# Altium project console_pcb_project.PrjPcb
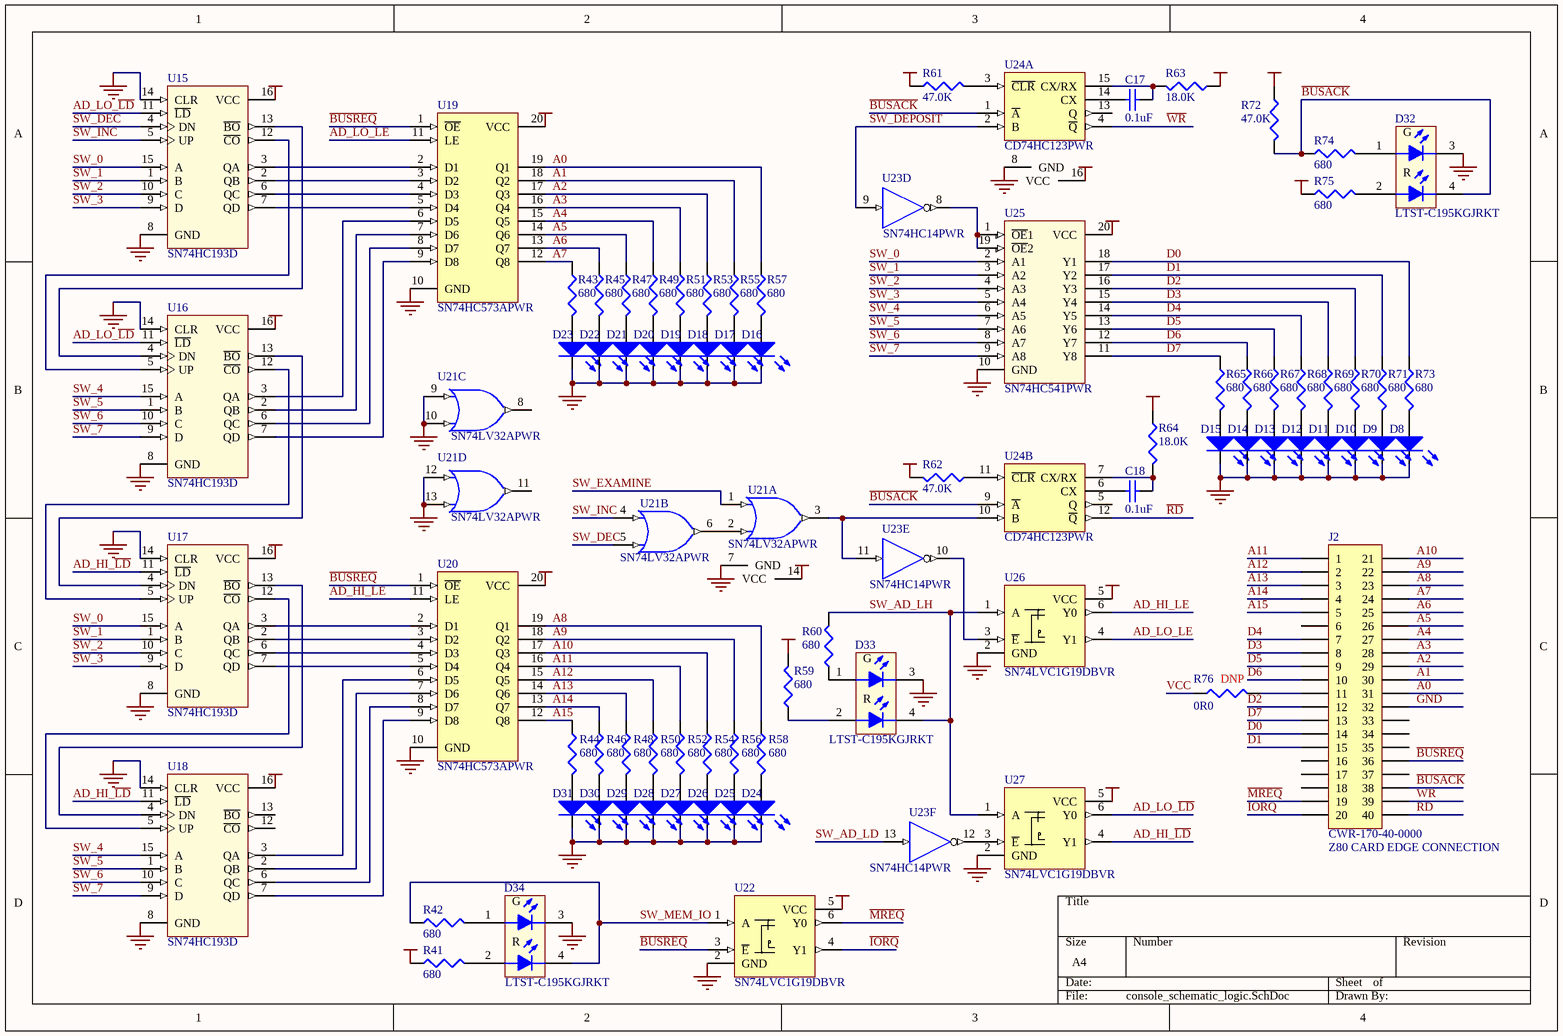
[diagram p0: console_schematic_logic.SchDoc]
2 sheets, 190 parts. Net scope: global (net labels, ports and power ports of the same name join across sheets).
Board file: console_pcb.PcbDoc
Sheets:
  console_schematic_logic.SchDoc
  console_schematic_switches.SchDoc

## Sheet console_schematic_logic.SchDoc
size A4

### Parts
C17  0.1uF  [0603]
C18  0.1uF  [0603]
D8  LTST-C190KRKT  [APG1608]  (value not drawn)
D9  LTST-C190KRKT  [APG1608]  (value not drawn)
D10  LTST-C190KRKT  [APG1608]  (value not drawn)
D11  LTST-C190KRKT  [APG1608]  (value not drawn)
D12  LTST-C190KRKT  [APG1608]  (value not drawn)
D13  LTST-C190KRKT  [APG1608]  (value not drawn)
D14  LTST-C190KRKT  [APG1608]  (value not drawn)
D15  LTST-C190KRKT  [APG1608]  (value not drawn)
D16  LTST-C190KRKT  [APG1608]  (value not drawn)
D17  LTST-C190KRKT  [APG1608]  (value not drawn)
D18  LTST-C190KRKT  [APG1608]  (value not drawn)
D19  LTST-C190KRKT  [APG1608]  (value not drawn)
D20  LTST-C190KRKT  [APG1608]  (value not drawn)
D21  LTST-C190KRKT  [APG1608]  (value not drawn)
D22  LTST-C190KRKT  [APG1608]  (value not drawn)
D23  LTST-C190KRKT  [APG1608]  (value not drawn)
D24  LTST-C190KRKT  [APG1608]  (value not drawn)
D25  LTST-C190KRKT  [APG1608]  (value not drawn)
D26  LTST-C190KRKT  [APG1608]  (value not drawn)
D27  LTST-C190KRKT  [APG1608]  (value not drawn)
D28  LTST-C190KRKT  [APG1608]  (value not drawn)
D29  LTST-C190KRKT  [APG1608]  (value not drawn)
D30  LTST-C190KRKT  [APG1608]  (value not drawn)
D31  LTST-C190KRKT  [APG1608]  (value not drawn)
D32  LTST-C195KGJRKT  [LTST-C195KGJRKT]
D33  LTST-C195KGJRKT  [LTST-C195KGJRKT]
D34  LTST-C195KGJRKT  [LTST-C195KGJRKT]
J2  CWR-170-40-0000  Notes: Z80 CARD EDGE CONNECTION  [CARD EDGE 40 PIN]
R41  680  [0603]
R42  680  [0603]
R43  680  [0603]
R44  680  [0603]
R45  680  [0603]
R46  680  [0603]
R47  680  [0603]
R48  680  [0603]
R49  680  [0603]
R50  680  [0603]
R51  680  [0603]
R52  680  [0603]
R53  680  [0603]
R54  680  [0603]
R55  680  [0603]
R56  680  [0603]
R57  680  [0603]
R58  680  [0603]
R59  680  [0603]
R60  680  [0603]
R61  47.0K  [0603]
R62  47.0K  [0603]
R63  18.0K  [0603]
R64  18.0K  [0603]
R65  680  [0603]
R66  680  [0603]
R67  680  [0603]
R68  680  [0603]
R69  680  [0603]
R70  680  [0603]
R71  680  [0603]
R72  47.0K  [0603]
R73  680  [0603]
R74  680  [0603]
R75  680  [0603]
R76  0R0  Load: DNP  [0603]
U15  SN74HC193D  [DO16 D R-PDSO-G16]
U16  SN74HC193D  [DO16 D R-PDSO-G16]
U17  SN74HC193D  [DO16 D R-PDSO-G16]
U18  SN74HC193D  [DO16 D R-PDSO-G16]
U19  SN74HC573APWR  [PW020]
U20  SN74HC573APWR  [PW020]
U21  SN74LV32APWR  [PW014]  (parts A,B,C,D of 4)
U22  SN74LVC1G19DBVR  [SOT-23-6 DBV R-PDSO-G6]
U23  SN74HC14PWR  [PW014]  (parts D,E,F of 6)
U24  CD74HC123PWR  [PW016]  (parts A,B of 2)
U25  SN74HC541PWR  [PW020]
U26  SN74LVC1G19DBVR  [SOT-23-6 DBV R-PDSO-G6]
U27  SN74LVC1G19DBVR  [SOT-23-6 DBV R-PDSO-G6]

### Nets
GND: D8.2(K) D9.2(K) D10.2(K) D11.2(K) D12.2(K) D13.2(K) D14.2(K) D15.2(K) D16.2(K) D17.2(K) D18.2(K) D19.2(K) D20.2(K) D21.2(K) D22.2(K) D23.2(K) D24.2(K) D25.2(K) D26.2(K) D27.2(K) D28.2(K) D29.2(K) D30.2(K) D31.2(K) D32.3(K1) D33.3(K1) D34.3(K1) J2.32 U15.8(GND) U15.14(CLR) U16.8(GND) U16.14(CLR) U17.8(GND) U17.14(CLR) U18.8(GND) U18.14(CLR) U19.10(GND) U20.10(GND) U21.7(GND) U21.9(A) U21.10(B) U21.12(A) U21.13(B) U22.2(GND) U23.7(GND) U24.8(GND) U25.10(GND) U26.2(GND) U27.2(GND)
VCC: R41.1 R59.2 R61.1 R62.2 R63.1 R64.1 R72.1 R75.1 R76.1 U15.16(VCC) U16.16(VCC) U17.16(VCC) U18.16(VCC) U19.20(VCC) U20.20(VCC) U21.14(VCC) U22.5(VCC) U23.14(VCC) U24.16(VCC) U25.20(VCC) U26.5(VCC) U27.5(VCC)
A0: J2.31 R57.1 U19.19(Q1)
A1: J2.30 R55.1 U19.18(Q2)
A2: J2.29 R53.1 U19.17(Q3)
A3: J2.28 R51.1 U19.16(Q4)
A4: J2.27 R49.1 U19.15(Q5)
A5: J2.26 R47.1 U19.14(Q6)
A6: J2.25 R45.1 U19.13(Q7)
A7: J2.24 R43.1 U19.12(Q8)
A8: J2.23 R58.1 U20.19(Q1)
A9: J2.22 R56.1 U20.18(Q2)
A10: J2.21 R54.1 U20.17(Q3)
A11: J2.1 R52.1 U20.16(Q4)
A12: J2.2 R50.1 U20.15(Q5)
A13: J2.3 R48.1 U20.14(Q6)
A14: J2.4 R46.1 U20.13(Q7)
A15: J2.5 R44.1 U20.12(Q8)
AD_HI_~{LD}: U17.11(~{LD}) U18.11(~{LD}) U27.4(Y1)
AD_HI_LE: U20.11(LE) U26.6(Y0)
AD_LO_~{LD}: U15.11(~{LD}) U16.11(~{LD}) U27.6(Y0)
AD_LO_LE: U19.11(LE) U26.4(Y1)
~{BUSACK}: D32.4(K2) J2.38 R72.2 R74.1 U24.1(~{A}) U24.9(~{A})
~{BUSREQ}: J2.36 U19.1(~{OE}) U20.1(~{OE}) U22.3(~{E})
D0: J2.14 R73.1 U25.18(Y1)
D1: J2.15 R71.1 U25.17(Y2)
D2: J2.12 R70.1 U25.16(Y3)
D3: J2.8 R69.1 U25.15(Y4)
D4: J2.7 R68.1 U25.14(Y5)
D5: J2.9 R67.1 U25.13(Y6)
D6: J2.10 R66.1 U25.12(Y7)
D7: J2.13 R65.1 U25.11(Y8)
~{IORQ}: J2.20 U22.4(Y1)
~{MREQ}: J2.19 U22.6(Y0)
~{RD}: J2.40 U24.12(~{Q})
SW_0: U15.15(A) U17.15(A) U25.2(A1)
SW_1: U15.1(B) U17.1(B) U25.3(A2)
SW_2: U15.10(C) U17.10(C) U25.4(A3)
SW_3: U15.9(D) U17.9(D) U25.5(A4)
SW_4: U16.15(A) U18.15(A) U25.6(A5)
SW_5: U16.1(B) U18.1(B) U25.7(A6)
SW_6: U16.10(C) U18.10(C) U25.8(A7)
SW_7: U16.9(D) U18.9(D) U25.9(A8)
SW_AD_LD: U23.13(A)
SW_AD_LH: D33.4(K2) R60.2 U26.1(A) U27.1(A)
SW_DEC: U15.4(DN) U21.5(B)
SW_DEPOSIT: U23.9(A) U24.2(B)
SW_EXAMINE: U21.1(A)
SW_INC: U15.5(UP) U21.4(A)
SW_MEM_IO: D34.4(K2) R42.1 U22.1(A)
~{WR}: J2.39 U24.4(~{Q})
NetC17_1: C17.1 U24.14(CX)
NetC17_2: C17.2 R63.2 U24.15(CX/RX)
NetC18_1: C18.1 U24.6(CX)
NetC18_2: C18.2 R64.2 U24.7(CX/RX)
NetD8_1: D8.1(A) R73.2
NetD9_1: D9.1(A) R71.2
NetD10_1: D10.1(A) R70.2
NetD11_1: D11.1(A) R69.2
NetD12_1: D12.1(A) R68.2
NetD13_1: D13.1(A) R67.2
NetD14_1: D14.1(A) R66.2
NetD15_1: D15.1(A) R65.2
NetD16_1: D16.1(A) R57.2
NetD17_1: D17.1(A) R55.2
NetD18_1: D18.1(A) R53.2
NetD19_1: D19.1(A) R51.2
NetD20_1: D20.1(A) R49.2
NetD21_1: D21.1(A) R47.2
NetD22_1: D22.1(A) R45.2
NetD23_1: D23.1(A) R43.2
NetD24_1: D24.1(A) R58.2
NetD25_1: D25.1(A) R56.2
NetD26_1: D26.1(A) R54.2
NetD27_1: D27.1(A) R52.2
NetD28_1: D28.1(A) R50.2
NetD29_1: D29.1(A) R48.2
NetD30_1: D30.1(A) R46.2
NetD31_1: D31.1(A) R44.2
NetD32_1: D32.1(A1) R74.2
NetD32_2: D32.2(A2) R75.2
NetD33_1: D33.1(A1) R60.1
NetD33_2: D33.2(A2) R59.1
NetD34_1: D34.1(A1) R42.2
NetD34_2: D34.2(A2) R41.2
NetJ2_11: J2.11 R76.2
NetR61_2: R61.2 U24.3(~{CLR})
NetR62_1: R62.1 U24.11(~{CLR})
NetU15_2: U15.2(QB) U19.3(D2)
NetU15_3: U15.3(QA) U19.2(D1)
NetU15_6: U15.6(QC) U19.4(D3)
NetU15_7: U15.7(QD) U19.5(D4)
NetU15_12: U15.12(~{CO}) U16.5(UP)
NetU15_13: U15.13(~{BO}) U16.4(DN)
NetU16_2: U16.2(QB) U19.7(D6)
NetU16_3: U16.3(QA) U19.6(D5)
NetU16_6: U16.6(QC) U19.8(D7)
NetU16_7: U16.7(QD) U19.9(D8)
NetU16_12: U16.12(~{CO}) U17.5(UP)
NetU16_13: U16.13(~{BO}) U17.4(DN)
NetU17_2: U17.2(QB) U20.3(D2)
NetU17_3: U17.3(QA) U20.2(D1)
NetU17_6: U17.6(QC) U20.4(D3)
NetU17_7: U17.7(QD) U20.5(D4)
NetU17_12: U17.12(~{CO}) U18.5(UP)
NetU17_13: U17.13(~{BO}) U18.4(DN)
NetU18_2: U18.2(QB) U20.7(D6)
NetU18_3: U18.3(QA) U20.6(D5)
NetU18_6: U18.6(QC) U20.8(D7)
NetU18_7: U18.7(QD) U20.9(D8)
NetU21_2: U21.2(B) U21.6(Y)
NetU21_3: U21.3(Y) U23.11(A) U24.10(B)
NetU23_8: U23.8(~{Y}) U25.1(~{OE}1) U25.19(~{OE}2)
NetU23_10: U23.10(~{Y}) U26.3(~{E})
NetU23_12: U23.12(~{Y}) U27.3(~{E})

Not connected (* = marked no-connect by the designer): J2 6 16 17 18 33 34 35 37; U18 12(~{CO}) 13(~{BO}); U21 8(Y) 11(Y); U24 5(Q) 13(Q)

### Notes on the sheet
- (in symbol LTST-C195KGJRKT) G; R

### Library data of the parts
C17 C18 = C0603: CAP .10UF 16V CERAMIC X7R 0603; Dist: Digi-key; DistPN: 399-1096-1-ND; Load: yes; Mfgr: Kemet; MfgrPN: C0603C104K4RACTU; Polarized: no; Value: 0.1uF; Notes: *; Package: 0603
D8-D31 = LTST-C190KRKT: LED SUPER RED CLEAR 0603 SMD; Dist: Digikey; DistPN: 160-1436-2-ND; Load: yes; Mfgr: Lite-On; MfgrPN: LTST-C190KRKT; Package: 0603; Polarized: yes; Value: LTST-C190KRKT
D32-D34 = LTST-C195KGJRKT: LED GREEN/RED BICOLOR 0606 SMD; Dist: Digi-key; DistPN: 160-1452-1-ND; Mfgr: Lite-On; Polarized: yes; MfgrPN: LTST-C195KGJRKT; Value: LTST-C195KGJRKT; Package: 0606; Load: yes
J2 = CWR-170-40-0000: CONN CARD EDGE 40PIN GOLD; Dist: Digi-Key; DistPN: CCE40G-ND; Load: no; Mfgr: CW Industries; Polarized: YES; MfgrPN: CWR-170-40-0000; Package: *; Value: CWR-170-40-0000
R41-R60 R65-R71 R73-R75 = MCR03EZPFX: RES 680 OHM 1/10W 1% 0603 SMD; Dist: Digi-Key; DistPN: P680HCT-ND; Mfgr: Panasonic; MfgrPN: ERJ-3EKF6800V; Load: yes; Polarized: no; Value: 680; Package: 0603
R61 R62 R72 = MCR03EZPFX: RES 47.0K OHM 1/10W 1% 0603 SMD; Dist: Digi-Key; DistPN: P47.0KHCT-ND; Mfgr: Panasonic; MfgrPN: ERJ-3EKF4702V; Load: yes; Polarized: no; Value: 47.0K; Package: 0603
R63 R64 = MCR03EZPFX: RES 18.0K OHM 1/10W 1% 0603 SMD; Dist: Digi-Key; DistPN: P18.0KHCT-ND; Mfgr: Panasonic; MfgrPN: ERJ-3EKF1802V; Load: yes; Polarized: no; Value: 18.0K; Package: 0603
R76 = ERJ-3EKF1002V: RES 0.0 OHM 1/10W 0603 SMD; Dist: Digikey; DistPN: P0.0GCT-ND; Mfgr: Panasonic; MfgrPN: ERJ-3GEY0R00V; Notes: JUMPER; Polarized: no; Value: 0R0; Package: 0603
U15-U18 = SN74HC193D: IC 4-BIT UP/DOWN COUNTER 16-SOIC; Dist: Digi-key; DistPN: 296-8261-5-ND; Load: yes; Mfgr: Texas Instruments; MfgrPN: SN74HC193D; Package: SOIC-16; Polarized: yes; Value: SN74HC193D
U19 U20 = SN74HC573APWR: IC OCTAL TRANSP LATCH 20-TSSOP; Dist: Digi-key; DistPN: 296-8338-1-ND; Mfgr: Texas Instruments; Polarized: yes; MfgrPN: SN74HC573APWR; Value: SN74HC573APWR; Package: TSSOP-20; Load: yes
U21 = SN74LV32APWR: IC QUAD 2-IN OR GATE 14-TSSOP; Dist: Digi-key; DistPN: 296-3819-1-ND; Mfgr: Texas Instruments; Polarized: yes; MfgrPN: SN74LV32APWR; Load: yes; Package: TSSOP-14; Value: SN74LV32APWR
U22 U26 U27 = SN74LVC1G19DBVR: IC MUX/DECODER SNGL 1OF2 SOT23-6; Dist: Mouser; DistPN: 595-SN74LVC1G19DCKR; Load: yes; Mfgr: Texas Instruments; MfgrPN: SN74LVC1G19DCKR; Package: TSSOP-6; Polarized: yes; Value: SN74LVC1G19DBVR
U23 = SN74HC14PWR: IC HEX SCHMITT-TRIG INV 14-TSSOP; Dist: Avnet; DistPN: SN74HC14PWR/BKN; Load: yes; Mfgr: Texas Instruments; MfgrPN: SN74HC14PWR; Package: TSSOP-14; Polarized: yes; Value: SN74HC14PWR
U24 = CD74HC123PWR: IC DUAL RETRIG MULTIVIB 16-TSSOP; Dist: Digi-key; DistPN: 296-12780-1-ND; Mfgr: Texas Instruments; Polarized: yes; MfgrPN: CD74HC123PWR; Package: TSSOP-16; Value: CD74HC123PWR; Load: yes
U25 = SN74HC541PWR: IC BUFF/DVR TRI-ST 8BIT 20TSSOP; Dist: Digi-Key; DistPN: 296-8335-1-ND; Load: yes; Mfgr: Texas Instruments; MfgrPN: SN74HC541PWR; Package: TSSOP-20; Polarized: yes; Value: SN74HC541PWR

## Sheet console_schematic_switches.SchDoc
size A4
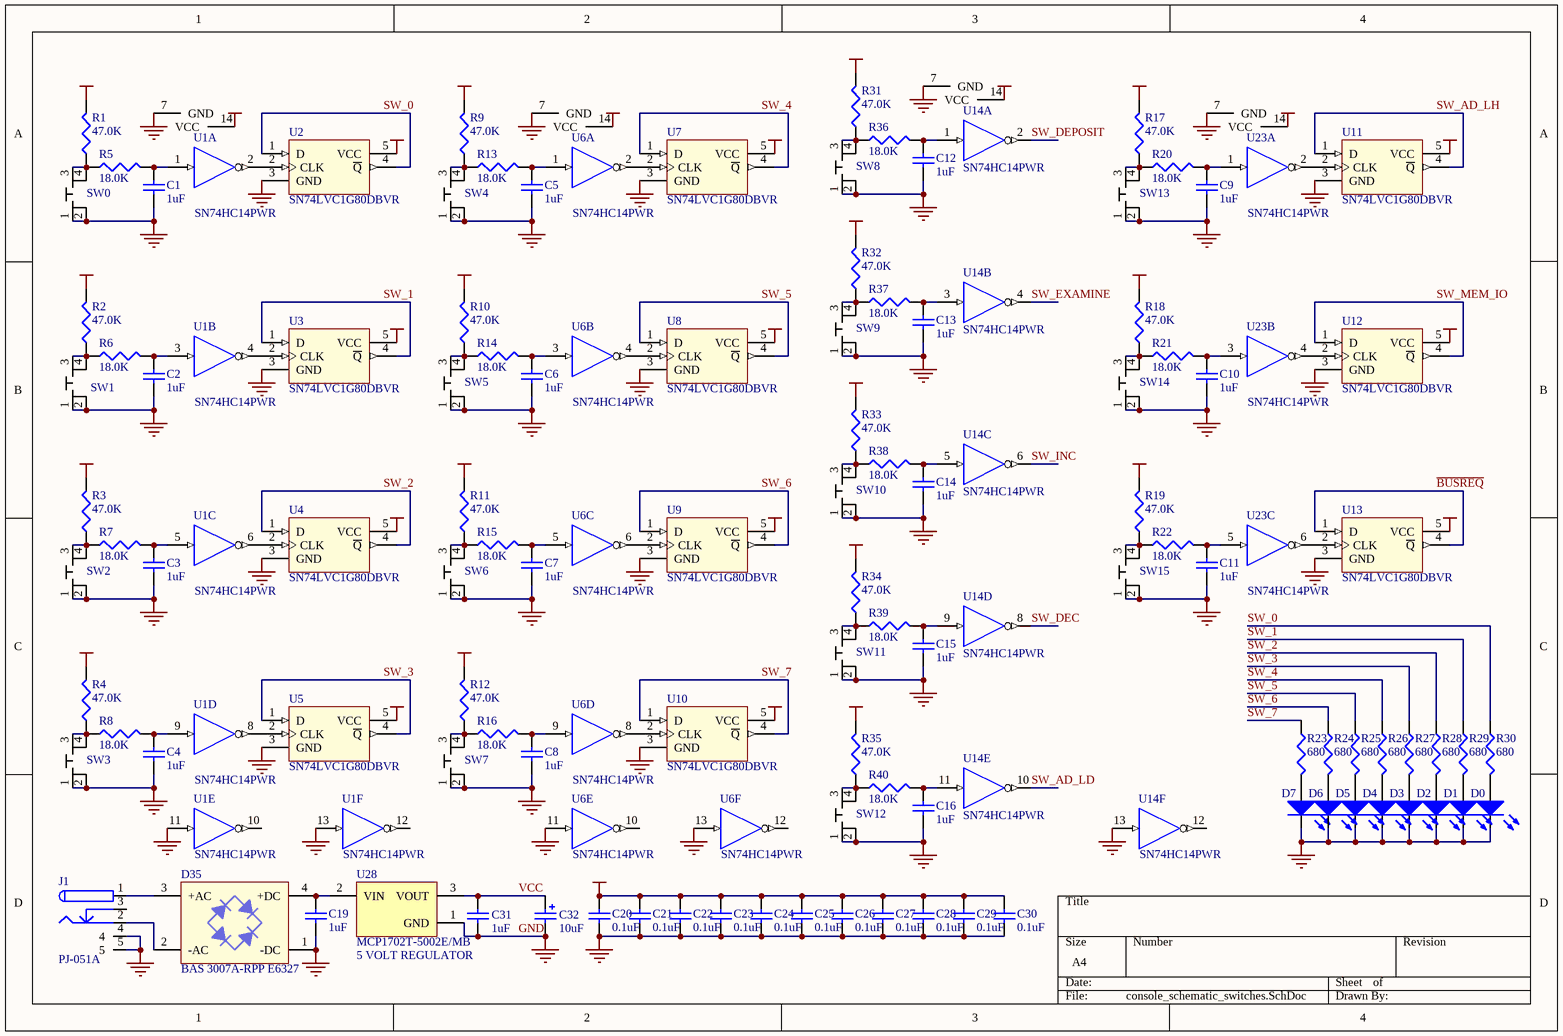
[diagram p1: console_schematic_switches.SchDoc]

### Parts
C1  1uF  [0805]
C2  1uF  [0805]
C3  1uF  [0805]
C4  1uF  [0805]
C5  1uF  [0805]
C6  1uF  [0805]
C7  1uF  [0805]
C8  1uF  [0805]
C9  1uF  [0805]
C10  1uF  [0805]
C11  1uF  [0805]
C12  1uF  [0805]
C13  1uF  [0805]
C14  1uF  [0805]
C15  1uF  [0805]
C16  1uF  [0805]
C19  1uF  [0805]
C20  0.1uF  [0603]
C21  0.1uF  [0603]
C22  0.1uF  [0603]
C23  0.1uF  [0603]
C24  0.1uF  [0603]
C25  0.1uF  [0603]
C26  0.1uF  [0603]
C27  0.1uF  [0603]
C28  0.1uF  [0603]
C29  0.1uF  [0603]
C30  0.1uF  [0603]
C31  1uF  [0805]
C32  10uF  [1206_A]
D0  LTST-C190KRKT  [APG1608]  (value not drawn)
D1  LTST-C190KRKT  [APG1608]  (value not drawn)
D2  LTST-C190KRKT  [APG1608]  (value not drawn)
D3  LTST-C190KRKT  [APG1608]  (value not drawn)
D4  LTST-C190KRKT  [APG1608]  (value not drawn)
D5  LTST-C190KRKT  [APG1608]  (value not drawn)
D6  LTST-C190KRKT  [APG1608]  (value not drawn)
D7  LTST-C190KRKT  [APG1608]  (value not drawn)
D35  BAS 3007A-RPP E6327  [SOT143]
J1  PJ-051A  [PJ-051A]
R1  47.0K  [0603]
R2  47.0K  [0603]
R3  47.0K  [0603]
R4  47.0K  [0603]
R5  18.0K  [0603]
R6  18.0K  [0603]
R7  18.0K  [0603]
R8  18.0K  [0603]
R9  47.0K  [0603]
R10  47.0K  [0603]
R11  47.0K  [0603]
R12  47.0K  [0603]
R13  18.0K  [0603]
R14  18.0K  [0603]
R15  18.0K  [0603]
R16  18.0K  [0603]
R17  47.0K  [0603]
R18  47.0K  [0603]
R19  47.0K  [0603]
R20  18.0K  [0603]
R21  18.0K  [0603]
R22  18.0K  [0603]
R23  680  [0603]
R24  680  [0603]
R25  680  [0603]
R26  680  [0603]
R27  680  [0603]
R28  680  [0603]
R29  680  [0603]
R30  680  [0603]
R31  47.0K  [0603]
R32  47.0K  [0603]
R33  47.0K  [0603]
R34  47.0K  [0603]
R35  47.0K  [0603]
R36  18.0K  [0603]
R37  18.0K  [0603]
R38  18.0K  [0603]
R39  18.0K  [0603]
R40  18.0K  [0603]
SW0  PTS645SM43SMTR LFS  [PTS645SM43SMTR LFS]  (value not drawn)
SW1  PTS645SM43SMTR LFS  [PTS645SM43SMTR LFS]  (value not drawn)
SW2  PTS645SM43SMTR LFS  [PTS645SM43SMTR LFS]  (value not drawn)
SW3  PTS645SM43SMTR LFS  [PTS645SM43SMTR LFS]  (value not drawn)
SW4  PTS645SM43SMTR LFS  [PTS645SM43SMTR LFS]  (value not drawn)
SW5  PTS645SM43SMTR LFS  [PTS645SM43SMTR LFS]  (value not drawn)
SW6  PTS645SM43SMTR LFS  [PTS645SM43SMTR LFS]  (value not drawn)
SW7  PTS645SM43SMTR LFS  [PTS645SM43SMTR LFS]  (value not drawn)
SW8  PTS645SM43SMTR LFS  [PTS645SM43SMTR LFS]  (value not drawn)
SW9  PTS645SM43SMTR LFS  [PTS645SM43SMTR LFS]  (value not drawn)
SW10  PTS645SM43SMTR LFS  [PTS645SM43SMTR LFS]  (value not drawn)
SW11  PTS645SM43SMTR LFS  [PTS645SM43SMTR LFS]  (value not drawn)
SW12  PTS645SM43SMTR LFS  [PTS645SM43SMTR LFS]  (value not drawn)
SW13  PTS645SM43SMTR LFS  [PTS645SM43SMTR LFS]  (value not drawn)
SW14  PTS645SM43SMTR LFS  [PTS645SM43SMTR LFS]  (value not drawn)
SW15  PTS645SM43SMTR LFS  [PTS645SM43SMTR LFS]  (value not drawn)
U1  SN74HC14PWR  [PW014]  (parts A,B,C,D,E,F of 6)
U2  SN74LVC1G80DBVR  [SOT-23-5 DBV R-PDSO-G5]
U3  SN74LVC1G80DBVR  [SOT-23-5 DBV R-PDSO-G5]
U4  SN74LVC1G80DBVR  [SOT-23-5 DBV R-PDSO-G5]
U5  SN74LVC1G80DBVR  [SOT-23-5 DBV R-PDSO-G5]
U6  SN74HC14PWR  [PW014]  (parts A,B,C,D,E,F of 6)
U7  SN74LVC1G80DBVR  [SOT-23-5 DBV R-PDSO-G5]
U8  SN74LVC1G80DBVR  [SOT-23-5 DBV R-PDSO-G5]
U9  SN74LVC1G80DBVR  [SOT-23-5 DBV R-PDSO-G5]
U10  SN74LVC1G80DBVR  [SOT-23-5 DBV R-PDSO-G5]
U11  SN74LVC1G80DBVR  [SOT-23-5 DBV R-PDSO-G5]
U12  SN74LVC1G80DBVR  [SOT-23-5 DBV R-PDSO-G5]
U13  SN74LVC1G80DBVR  [SOT-23-5 DBV R-PDSO-G5]
U14  SN74HC14PWR  [PW014]  (parts A,B,C,D,E,F of 6)
U23  SN74HC14PWR  [PW014]  (parts A,B,C of 6)
U28  MCP1702T-5002E/MB  Notes: 5 VOLT REGULATOR  [SOT-89]

### Nets
GND: C1.1 C2.1 C3.1 C4.1 C5.1 C6.1 C7.1 C8.1 C9.1 C10.1 C11.1 C12.1 C13.1 C14.1 C15.1 C16.1 C19.2 C20.1 C21.1 C22.1 C23.1 C24.1 C25.1 C26.1 C27.1 C28.1 C29.1 C30.1 C31.2 C32.2 D0.2(K) D1.2(K) D2.2(K) D3.2(K) D4.2(K) D5.2(K) D6.2(K) D7.2(K) D35.1(-DC) J1.4 J1.5 SW0.1 SW0.2 SW1.1 SW1.2 SW2.1 SW2.2 SW3.1 SW3.2 SW4.1 SW4.2 SW5.1 SW5.2 SW6.1 SW6.2 SW7.1 SW7.2 SW8.1 SW8.2 SW9.1 SW9.2 SW10.1 SW10.2 SW11.1 SW11.2 SW12.1 SW12.2 SW13.1 SW13.2 SW14.1 SW14.2 SW15.1 SW15.2 U1.7(GND) U1.11(A) U1.13(A) U2.3(GND) U3.3(GND) U4.3(GND) U5.3(GND) U6.7(GND) U6.11(A) U6.13(A) U7.3(GND) U8.3(GND) U9.3(GND) U10.3(GND) U11.3(GND) U12.3(GND) U13.3(GND) U14.7(GND) U14.13(A) U23.7(GND) U28.1(GND)
VCC: C20.2 C21.2 C22.2 C23.2 C24.2 C25.2 C26.2 C27.2 C28.2 C29.2 C30.2 C31.1 C32.1 R1.2 R2.2 R3.2 R4.2 R9.2 R10.2 R11.2 R12.2 R17.2 R18.2 R19.2 R31.2 R32.2 R33.2 R34.2 R35.2 U1.14(VCC) U2.5(VCC) U3.5(VCC) U4.5(VCC) U5.5(VCC) U6.14(VCC) U7.5(VCC) U8.5(VCC) U9.5(VCC) U10.5(VCC) U11.5(VCC) U12.5(VCC) U13.5(VCC) U14.14(VCC) U23.14(VCC) U28.3(VOUT)
~{BUSREQ}: U13.1(D) U13.4(~{Q})
SW_0: R30.1 U2.1(D) U2.4(~{Q})
SW_1: R29.1 U3.1(D) U3.4(~{Q})
SW_2: R28.1 U4.1(D) U4.4(~{Q})
SW_3: R27.1 U5.1(D) U5.4(~{Q})
SW_4: R26.1 U7.1(D) U7.4(~{Q})
SW_5: R25.1 U8.1(D) U8.4(~{Q})
SW_6: R24.1 U9.1(D) U9.4(~{Q})
SW_7: R23.1 U10.1(D) U10.4(~{Q})
SW_AD_LD: U14.10(~{Y})
SW_AD_LH: U11.1(D) U11.4(~{Q})
SW_DEC: U14.8(~{Y})
SW_DEPOSIT: U14.2(~{Y})
SW_EXAMINE: U14.4(~{Y})
SW_INC: U14.6(~{Y})
SW_MEM_IO: U12.1(D) U12.4(~{Q})
NetC1_2: C1.2 R5.2 U1.1(A)
NetC2_2: C2.2 R6.2 U1.3(A)
NetC3_2: C3.2 R7.2 U1.5(A)
NetC4_2: C4.2 R8.2 U1.9(A)
NetC5_2: C5.2 R13.2 U6.1(A)
NetC6_2: C6.2 R14.2 U6.3(A)
NetC7_2: C7.2 R15.2 U6.5(A)
NetC8_2: C8.2 R16.2 U6.9(A)
NetC9_2: C9.2 R20.2 U23.1(A)
NetC10_2: C10.2 R21.2 U23.3(A)
NetC11_2: C11.2 R22.2 U23.5(A)
NetC12_2: C12.2 R36.2 U14.1(A)
NetC13_2: C13.2 R37.2 U14.3(A)
NetC14_2: C14.2 R38.2 U14.5(A)
NetC15_2: C15.2 R39.2 U14.9(A)
NetC16_2: C16.2 R40.2 U14.11(A)
NetC19_1: C19.1 D35.4(+DC) U28.2(VIN)
NetD0_1: D0.1(A) R30.2
NetD1_1: D1.1(A) R29.2
NetD2_1: D2.1(A) R28.2
NetD3_1: D3.1(A) R27.2
NetD4_1: D4.1(A) R26.2
NetD5_1: D5.1(A) R25.2
NetD6_1: D6.1(A) R24.2
NetD7_1: D7.1(A) R23.2
NetD35_2: D35.2(-AC) J1.2
NetD35_3: D35.3(+AC) J1.1
NetR1_1: R1.1 R5.1 SW0.3 SW0.4
NetR2_1: R2.1 R6.1 SW1.3 SW1.4
NetR3_1: R3.1 R7.1 SW2.3 SW2.4
NetR4_1: R4.1 R8.1 SW3.3 SW3.4
NetR9_1: R9.1 R13.1 SW4.3 SW4.4
NetR10_1: R10.1 R14.1 SW5.3 SW5.4
NetR11_1: R11.1 R15.1 SW6.3 SW6.4
NetR12_1: R12.1 R16.1 SW7.3 SW7.4
NetR17_1: R17.1 R20.1 SW13.3 SW13.4
NetR18_1: R18.1 R21.1 SW14.3 SW14.4
NetR19_1: R19.1 R22.1 SW15.3 SW15.4
NetR31_1: R31.1 R36.1 SW8.3 SW8.4
NetR32_1: R32.1 R37.1 SW9.3 SW9.4
NetR33_1: R33.1 R38.1 SW10.3 SW10.4
NetR34_1: R34.1 R39.1 SW11.3 SW11.4
NetR35_1: R35.1 R40.1 SW12.3 SW12.4
NetU1_2: U1.2(~{Y}) U2.2(CLK)
NetU1_4: U1.4(~{Y}) U3.2(CLK)
NetU1_6: U1.6(~{Y}) U4.2(CLK)
NetU1_8: U1.8(~{Y}) U5.2(CLK)
NetU6_2: U6.2(~{Y}) U7.2(CLK)
NetU6_4: U6.4(~{Y}) U8.2(CLK)
NetU6_6: U6.6(~{Y}) U9.2(CLK)
NetU6_8: U6.8(~{Y}) U10.2(CLK)
NetU11_2: U11.2(CLK) U23.2(~{Y})
NetU12_2: U12.2(CLK) U23.4(~{Y})
NetU13_2: U13.2(CLK) U23.6(~{Y})

Not connected (* = marked no-connect by the designer): J1 3; U1 10(~{Y}) 12(~{Y}); U6 10(~{Y}) 12(~{Y}); U14 12(~{Y})

### Library data of the parts
C1-C16 C19 = C0805: CAP 1.0UF 16V CERAMIC X7R 0805; Dist: Digi-key; DistPN: 399-1284-1-ND; Load: yes; Mfgr: Kemet; MfgrPN: C0805C105K4RACTU; Polarized: no; Value: 1uF; Package: 0805
  C19: Notes: *
C20 = C0603: CAP .10UF 16V CERAMIC X7R 0603; Dist: Digi-Key; DistPN: 399-1096-1-ND; Load: yes; Mfgr: Kemet; MfgrPN: C0603C104K4RACTU; Polarized: no; Value: 0.1uF; Notes: *; Package: 0603
C21-C30 = C0603: as C17 on sheet console_schematic_logic; Value: 0.1uF; Notes: *; Package: 0603
C31 = C0805: CAP 1.0UF 16V CERAMIC X7R 0805; Dist: Digi-Key; DistPN: 399-1284-1-ND; Load: yes; Mfgr: Kemet; MfgrPN: C0805C105K4RACTU; Polarized: no; Value: 1uF; Notes: *; Package: 0805
C32 = T491A: CAPACITOR TANT 10UF 10V 10% SMD; Dist: Avnet; DistPN: T491A106K010AT/BKN; Load: yes; Mfgr: Kemet; MfgrPN: T491A106K010AT; Value: 10uF; Notes: *; Package: 1206; Polarized: YES
D0-D7 = LTST-C190KRKT: as D8 on sheet console_schematic_logic; MfgrPN: LTST-C190KRKT; Package: 0603; Polarized: yes; Value: LTST-C190KRKT
D35 = BAS 3007A-RPP E6327: DIODE SCHOTTKY 30V 900MA SOT143; Dist: Digi-Key; DistPN: BAS3007A-RPPE6327INCT-ND; Load: yes; Mfgr: Infineon Technologies; MfgrPN: BAS 3007A-RPP E6327; Notes: *; Package: SOT-143; Polarized: yes; Value: BAS 3007A-RPP E6327
J1 = PJ-051A: CON PWR JCK 2.0 X 6.0MM W/SHLD; Dist: Digi-Key; DistPN: CP-051A-ND; Load: yes; Mfgr: CUI Inc; MfgrPN: PJ-051A; Package: PTH; Polarized: yes; Value: PJ-051A
R1-R4 R9-R12 R17-R19 R31-R35 = MCR03EZPFX: as R61 on sheet console_schematic_logic; Value: 47.0K; Package: 0603
R5-R8 R13-R16 R20-R22 R36-R40 = MCR03EZPFX: as R63 on sheet console_schematic_logic; Value: 18.0K; Package: 0603
R23-R30 = MCR03EZPFX: as R41 on sheet console_schematic_logic; Value: 680; Package: 0603
SW0-SW15 = PTS645SM43SMTR LFS: SWITCH TACT 6MM 160GF H=4.3MM; Dist: Mouser; DistPN: 611-PTS645SM43SMTRLF; Load: yes; Mfgr: C&K Components; Polarized: no; MfgrPN: PTS645SM43SMTR LFS; Package: SMD-6x6
U1 U6 U14 U23 = SN74HC14PWR: as U23 on sheet console_schematic_logic; MfgrPN: SN74HC14PWR; Package: TSSOP-14; Polarized: yes; Value: SN74HC14PWR
U2-U5 U7-U13 = SN74LVC1G80DBVR: IC POSITIVE D-TYPE F-F SOT-23-5; Dist: Digi-key; DistPN: 296-9851-1-ND; Load: yes; Mfgr: Texas Instruments; MfgrPN: SN74LVC1G80DBVR; Package: SOT-23-5; Polarized: yes; Value: SN74LVC1G80DBVR
U28 = MCP1702T-5002E/MB: IC REG LDO 5V 250MA SOT-89-3; Dist: Mouser; DistPN: 579-MCP1702T5002E/MB; Load: yes; Mfgr: Microchip; MfgrPN: MCP1702T-5002E/MB; Package: SOT-89; Polarized: YES; Value: MCP1702T-5002E/MB

## Nets that join several sheets
GND: console_schematic_logic (49 pins), console_schematic_switches (94 pins)
VCC: console_schematic_logic (22 pins), console_schematic_switches (45 pins)
~{BUSREQ}: console_schematic_logic (J2.36 U19.1 U20.1 U22.3), console_schematic_switches (U13.1 U13.4)
SW_0: console_schematic_logic (U15.15 U17.15 U25.2), console_schematic_switches (R30.1 U2.1 U2.4)
SW_1: console_schematic_logic (U15.1 U17.1 U25.3), console_schematic_switches (R29.1 U3.1 U3.4)
SW_2: console_schematic_logic (U15.10 U17.10 U25.4), console_schematic_switches (R28.1 U4.1 U4.4)
SW_3: console_schematic_logic (U15.9 U17.9 U25.5), console_schematic_switches (R27.1 U5.1 U5.4)
SW_4: console_schematic_logic (U16.15 U18.15 U25.6), console_schematic_switches (R26.1 U7.1 U7.4)
SW_5: console_schematic_logic (U16.1 U18.1 U25.7), console_schematic_switches (R25.1 U8.1 U8.4)
SW_6: console_schematic_logic (U16.10 U18.10 U25.8), console_schematic_switches (R24.1 U9.1 U9.4)
SW_7: console_schematic_logic (U16.9 U18.9 U25.9), console_schematic_switches (R23.1 U10.1 U10.4)
SW_AD_LD: console_schematic_logic (U23.13), console_schematic_switches (U14.10)
SW_AD_LH: console_schematic_logic (D33.4 R60.2 U26.1 U27.1), console_schematic_switches (U11.1 U11.4)
SW_DEC: console_schematic_logic (U15.4 U21.5), console_schematic_switches (U14.8)
SW_DEPOSIT: console_schematic_logic (U23.9 U24.2), console_schematic_switches (U14.2)
SW_EXAMINE: console_schematic_logic (U21.1), console_schematic_switches (U14.4)
SW_INC: console_schematic_logic (U15.5 U21.4), console_schematic_switches (U14.6)
SW_MEM_IO: console_schematic_logic (D34.4 R42.1 U22.1), console_schematic_switches (U12.1 U12.4)